# EAGLE design OPT3001 (EAGLE 8.7.0)
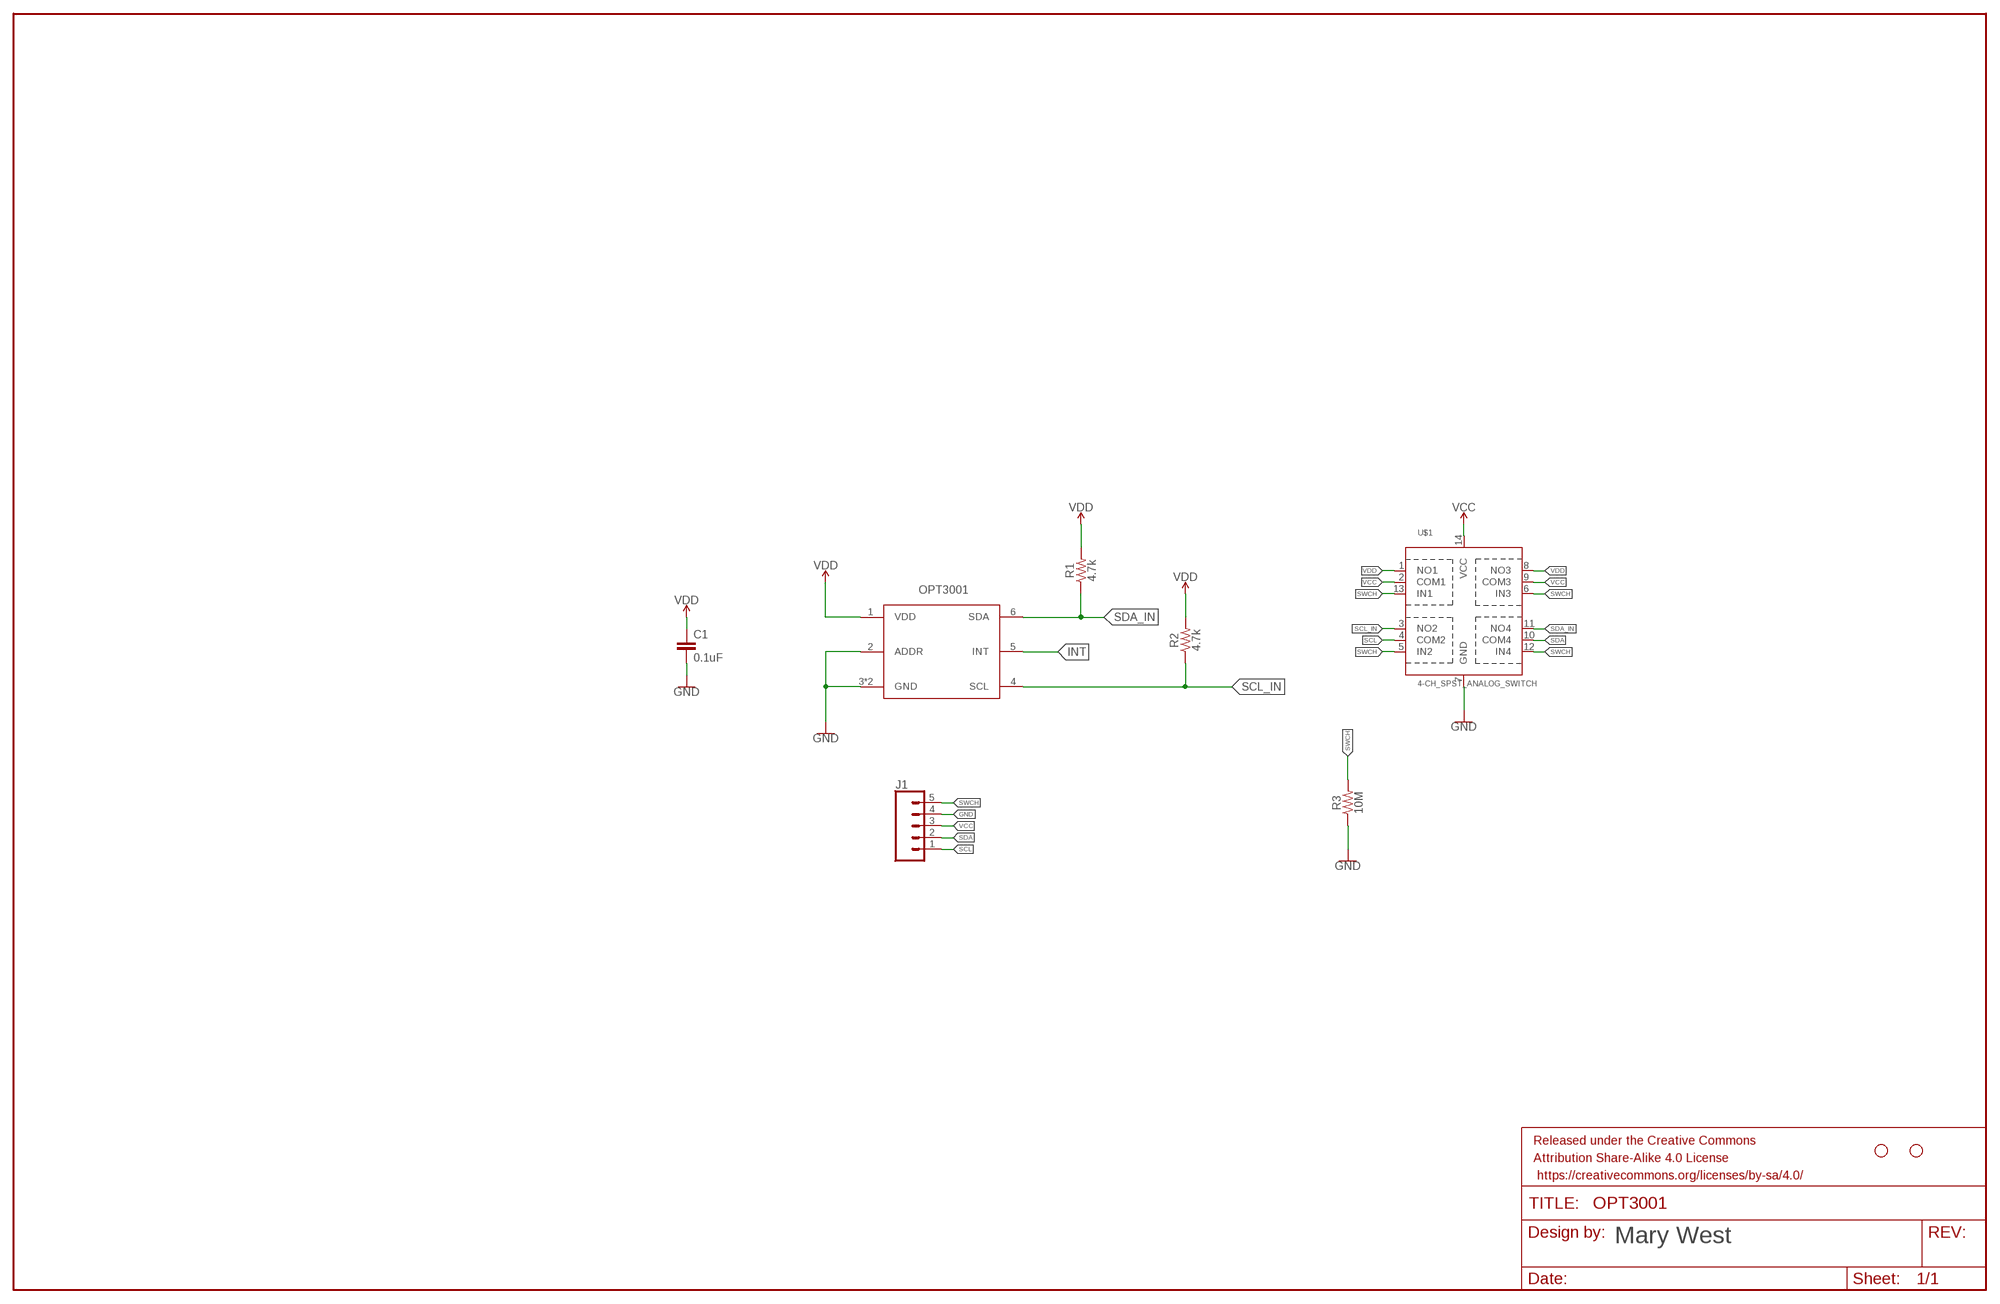
[diagram p0: schematic, sheet 1]

## Parts
C1  0.1uF  0.1UF-0603-25V-(+80/-20%)  [0603]
FRAME1  FRAME-LEDGER  [CREATIVE_COMMONS]
H1  STAND-OFF  [STAND-OFF]
H2  STAND-OFF  [STAND-OFF]
J1  CONN_05  [1X05]
OPT3001  OPT3001DNPT  [6PIN_USON]
R1  4.7k  4.7KOHM-0603-1/10W-1%  [0603]
R2  4.7k  4.7KOHM-0603-1/10W-1%  [0603]
R3  10M  10MOHM-0603-1/10W-5%  [0603]
U$1  4-CH_SPST_ANALOG_SWITCH  [TSSOP14]

## Nets
GND: C1.2 J1.4 OPT3001.2(ADDR) OPT3001.3(GND) OPT3001.GND R3.1 U$1.7(GND)
INT: OPT3001.5(INT)
SCL: J1.1 U$1.4(COM2)
SCL_IN: OPT3001.4(SCL) R2.1 U$1.3(NO2)
SDA: J1.2 U$1.10(COM4)
SDA_IN: OPT3001.6(SDA) R1.1 U$1.11(NO4)
SWCH: J1.5 R3.2 U$1.5(IN2) U$1.6(IN3) U$1.12(IN4) U$1.13(IN1)
VCC: J1.3 U$1.2(COM1) U$1.9(COM3) U$1.14(VCC)
VDD: C1.1 OPT3001.1(VDD) R1.2 R2.2 U$1.1(NO1) U$1.8(NO3)

## Notes on the sheet
- Mary West

## Library data of the parts
C1 = SparkFun-Capacitors:0.1UF: 0.1µF ceramic capacitors A capacitor is a passive two-terminal electrical component used to store electrical energy temporarily in an electric field.; PROD_ID: CAP-00810
FRAME1 = SparkFun-Aesthetics:FRAME-LEDGER: Schematic Frame - Ledger Standard 11x14 US Ledger frame
H1 H2 = SparkFun-Hardware:STAND-OFF: Stand Off Drill holes for mechanically mounting via screws, standoffs, etc. Note: Use the keepout ring to avoid running the screw head into surrounding components. Variant Overviews STAND-OFF - Mechanical footprint for a #4 phillips button head screw. STAND-OFF-TIGHT - Mechanical footprint for a #4 phillips button head screw, Example SparkFun Products Screw - Phillips Head (1/4", 4-40, 10 pack) <https://www.sparkfun.com/products/10453> (PRT-10453) Screw - Phillips Head (1/2", 4-40, 10 pack) <https://www.sparkfun.com/products/10452> (PRT-10452) Screw - Phillips Head (3/4", 4-40, 10 pack) <https://www.sparkfun.com/products/10451> (PRT-10451) Screw - Phillips Head (1", 4-40, 10 pack) <https://www.sparkfun.com/products/10450> (PRT-10450)
J1 = SparkFun-Connectors:CONN_05: Multi connection point. Often used as Generic Header-pin footprint for 0.1 inch spaced/style header connections On any of the 0.1 inch spaced packages, you can populate with these: Break Away Headers - Straight <https://www.sparkfun.com/products/116> (PRT-00116) Break Away Male Headers - Right Angle <https://www.sparkfun.com/products/553> (PRT-00553) Female Headers <https://www.sparkfun.com/products/115> (PRT-00115) Break Away Headers - Machine Pin <https://www.sparkfun.com/products/117> (PRT-00117) Break Away Female Headers - Swiss Machine Pin <https://www.sparkfun.com/products/743> (PRT-00743) For SCREWTERMINALS and SPRING TERMINALS visit here: Screw Terimnals on SparkFun.com <https://www.sparkfun.com/search/results?term=Screw+Terminals> (5mm/3.5mm/2.54mm spacing) This device is also useful as a general connection point to wire up your design to another part of your project. Our various solder wires solder well into these plated through hole pads. Hook-Up Wire - Assortment (Stranded, 22 AWG) <https://www.sparkfun.com/products/11375> (PRT-11375) Hook-Up Wire - Assortment (Solid Core, 22 AWG) <https://www.sparkfun.com/products/11367> (PRT-11367) View the entire wire category on our website here <https://www.sparkfun.com/categories/141> Special notes: Molex polarized connector foot print use with SKU : PRT-08231 with associated crimp pins and housings. 1MM SMD Version SKU: PRT-10208
OPT3001 = ALS_OPT3001:OPT3001DNPT
R1 R2 = SparkFun-Resistors:4.7KOHM: 4.7kΩ resistor A resistor is a passive two-terminal electrical component that implements electrical resistance as a circuit element. Resistors act to reduce current flow, and, at the same time, act to lower voltage levels within circuits. - Wikipedia; PROD_ID: RES-07857
R3 = SparkFun-Resistors:10MOHM: RES-09327; PROD_ID: RES-08283
U$1 = 4chAnalogSwitch:4-CH_SPST_ANALOG_SWITCH

## Board
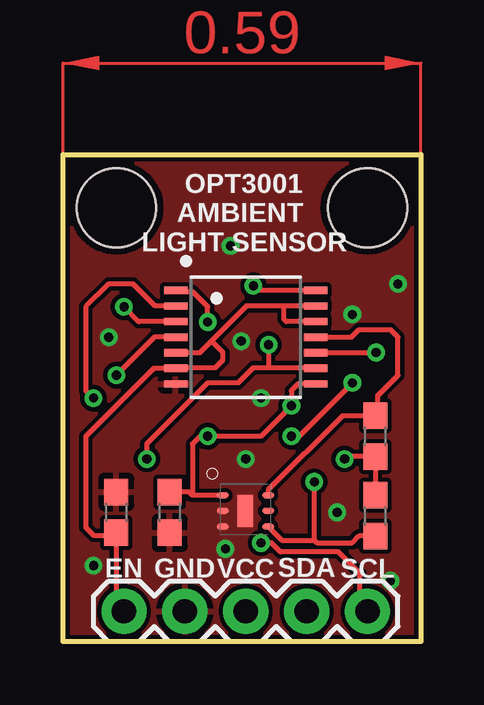
[diagram p1: board, top side]
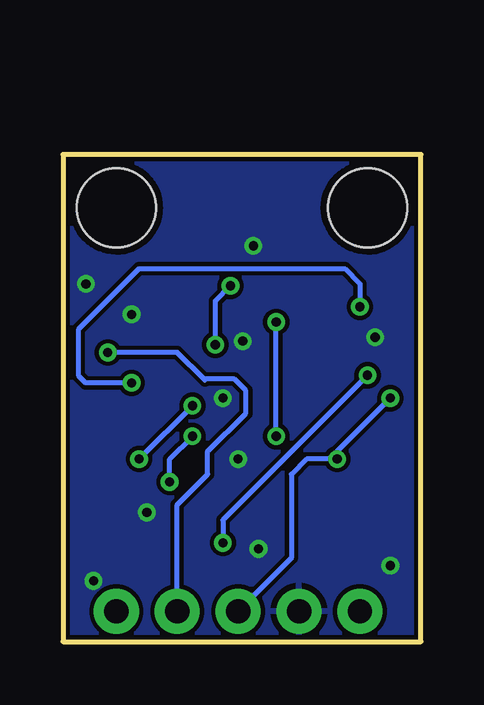
[diagram p2: board, bottom side, seen from below]

Size 14.92 x 20.32 mm. Coordinates in mm from the lower left corner, seen from the top.
Outline: 0,0 0,20.32 14.92,20.32 14.92,0 0,0
Copper layers (1*16): Top 0.035mm / dielectric 1.5mm / Bottom 0.035mm
Design rules "SparkFun-2-layer-TIGHT": minimum track width 7mil, minimum drill 15mil, track to track 7mil, track to pad 7mil, pad to pad 7mil, via to via 7mil, smd to smd 7mil, copper to edge 7mil, drill to drill 7mil, minimum pad ring 7mil, minimum via ring 7mil, stop-mask expansion 4mil, vias tented up to drill 25mil, thermal gap 10mil

### Footprints (pad centres in the part's own frame; a part is rotated, then mirrored left to right if it is on the bottom)
0603 = smd 1.1 x 1: 1 -0.85,0; 2 0.85,0
STAND-OFF = hole 3.302: 0,0
1X05 = drill 1.016 pad 1.88: 1 0,0; 2 2.54,0; 3 5.08,0; 4 7.62,0; 5 10.16,0
6PIN_USON = smd 0.5 x 0.25: 1 0.1,1.625; 2 0.1,0.975; 3 0.1,0.325; 4 2,0.325; 5 2,0.975; 6 2,1.625 | smd 0.65 x 1.35: GND 1.05,0.975
TSSOP14 = smd 0.305 x 0.991: 1 -1.95,-2.918; 2 -1.3,-2.918; 3 -0.65,-2.918; 4 0,-2.918; 5 0.65,-2.918; 6 1.3,-2.918; 7 1.95,-2.918; 8 1.95,2.918; 9 1.3,2.918; 10 0.65,2.918; 11 0,2.918; 12 -0.65,2.918; 13 -1.3,2.918; 14 -1.95,2.918

### Placement (x,y rotation side)
C1  4.45,5.4 270 top
FRAME1  13.97,-8.89 0 top  (outside the outline)
H1  2.22,18.1 0 top
H2  12.7,18.1 0 top
J1  12.7,1.27 180 top
OPT3001  6.55,4.48 0 top
R1  13.02,8.57 270 top
R2  13.02,5.26 90 top
R3  2.22,5.4 270 top
U$1  7.62,12.7 270 top

### Tracks (layer width: path | path; a pad name or v marks a point on that pad's centre or on a via)
GND  (via drill 0.38)
  other vias: 8.26,10.16 6.77,3.87 13.65,2.54 11.43,5.4 7.62,7.62 1.27,3.17 6.99,16.51 13.97,14.92 12.06,13.65 1.91,12.7 7.43,12.53
  pour Top: 0,0 0,20.32 14.92,20.32 14.92,0
  pour Bottom: 0,0 0,20.32 14.92,20.32 14.92,0
SCL  (via drill 0.38)
  Top 0.203: U$1.4 3.81,12.7 v2.22,11.11 | J1.1 12.38,1.59 12.38,2.86 11.49,3.75 9.08,3.75 8.7,4.13 v8.26,4.13
  Bottom 0.203: v8.26,4.13 8.26,5.08 v2.22,11.11
SCL_IN  (via drill 0.38)
  Top 0.203: OPT3001.4 9.13,4.23 10.48,4.23 | v9.53,8.57 9.84,8.57 v12.06,10.79 | 10.48,4.23 v10.48,6.67 | v2.54,13.97 3.16,13.35 U$1.3 | R2.1 12.35,4.41 12.06,4.13 10.58,4.13 10.48,4.23
  Bottom 0.203: v10.48,6.67 10.48,7.62 v9.53,8.57 | v12.06,10.79 13.97,10.79 14.29,11.11 14.29,13.02 11.75,15.56 3.17,15.56 2.54,14.92 v2.54,13.97
SDA  (via drill 0.38)
  Top 0.203: U$1.10 10.55,12.06 v13.06,12.06
  Bottom 0.203: 10.16,1.8 J1.2 10.16,5.71 8.89,6.99 8.89,7.94 7.3,9.53 7.3,10.48 7.78,10.95 9.05,10.95 | 9,10.91 9.05,10.95 | 9.05,10.95 10.16,12.06 v13.06,12.06
SDA_IN
  Top 0.203: OPT3001.6 8.55,6.33 11.64,9.42 R1.1 13.12,9.53 13.12,10.26 13.97,11.11 13.97,12.7 13.65,13.02 12.35,13.02 12.03,12.7 U$1.11
SWCH
  Top 0.203: U$1.13 9.21,14 | 9.21,14 7.65,14 6.19,12.54 | U$1.5 5.7,12.05 6.19,12.54 | 10.52,13.34 U$1.12 9.31,13.35 9.21,13.45 9.21,14 | 6.19,12.54 6.67,12.06 6.67,11.75 6.35,11.43 4.73,11.43 U$1.6 3.78,11.4 0.95,8.57 0.95,4.76 1.27,4.45 2.22,4.45 | J1.5 2.22,1.59 2.22,4.45 | R3.2 2.22,4.45
VCC  (via drill 0.38)
  Top 0.203: U$1.9 10.51,11.43 8.57,11.43 | 8.57,11.43 7.94,11.43 7.3,10.79 6.03,10.79 3.49,8.26 v3.49,7.62 | U$1.2 3.84,14 2.92,14.92 1.91,14.92 0.95,13.97 0.95,10.48 v1.27,10.16 | v8.57,12.38 8.57,11.43 | v7.94,14.85 8.13,14.65 U$1.14
  Bottom 0.203: v1.27,10.16 3.49,7.94 v3.49,7.62 4.76,7.62 5.4,6.99 5.4,3.49 J1.3 | v7.94,14.85 8.57,14.21 v8.57,12.38
VDD  (via drill 0.38)
  Top 0.203: OPT3001.1 5.4,6.11 | 5.4,6.11 5.4,8.26 5.71,8.57 v6.03,8.57 8.26,8.57 v9.53,9.84 9.53,10.48 9.8,10.75 U$1.8 | R2.2 R1.2 11.85,7.72 v11.75,7.62 | v6.03,13.34 6.03,13.97 5.4,14.61 4.75,14.61 U$1.1 | 5.4,6.11 5.26,6.25 C1.1
  Bottom 0.203: v9.53,9.84 v11.75,7.62 | v6.03,8.57 v6.03,13.34
(copper drawn outside any net)
  shapes: Top area x2

### Text on the board
tPlace: OPT3001 / AMBIENT / LIGHT SENSOR | SDA | EN | GND | VCC | SCL